# Altium schematic sheet READ.SchDoc: FMC-320U - MODELO A - PCB 1
size A4; SheetNumber: 1; SheetTotal: 7; thisVersion: 1; ThisRevision: 1; ThisRelease: 1
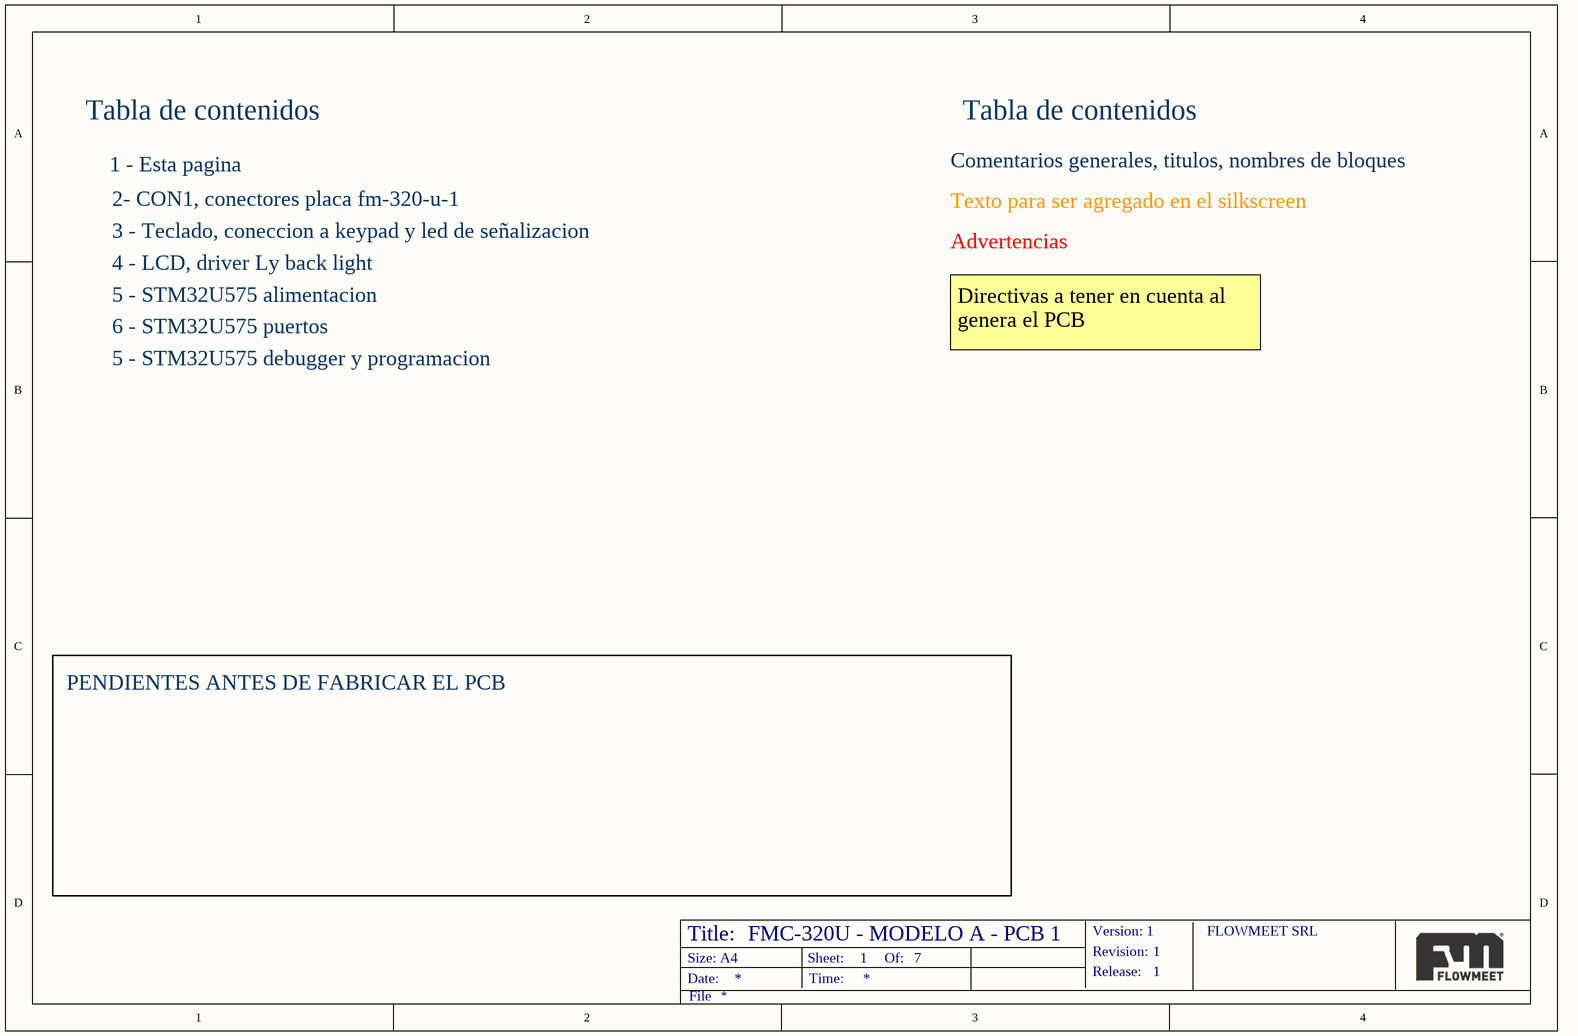
[diagram p0: READ.SchDoc]

## Notes on the sheet
- Tabla de contenidos
- 1 - Esta pagina
- Comentarios generales, titulos, nombres de bloques
- 2- CON1, conectores placa fm-320-u-1
- 3 - Teclado, coneccion a keypad y led de señalizacion
- Texto para ser agregado en el silkscreen
- Advertencias
- 4 - LCD, driver Ly back light
- 5 - STM32U575 alimentacion
- 6 - STM32U575 puertos
- 5 - STM32U575 debugger y programacion
- Directivas a tener en cuenta al genera el PCB
- PENDIENTES ANTES DE FABRICAR EL PCB
- Title:
- Size: A4
- Date:
- Sheet:
- Time:
- Of:
- Version:
- Revision:
- Release:
- FLOWMEET SRL
- File